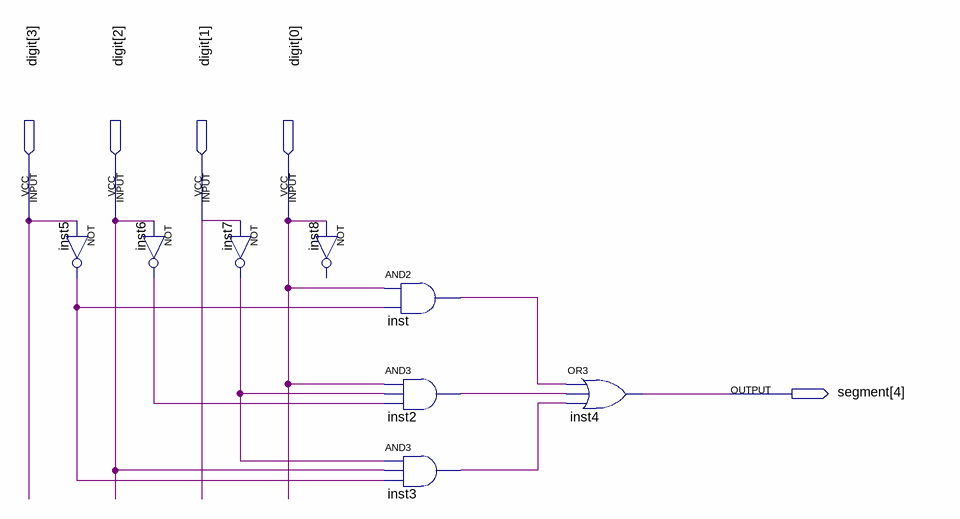
[diagram p0: schematic sheet]
// Quartus schematic segmentE.bdf as structural Verilog: 8 symbols, 5 pins
module segmentE (
  input  [3:0] digit,
  output [4:4] segment
);

  wire inst2_out, inst3_out, inst5_out, inst6_out, inst7_out, inst_out;

  not inst5 (inst5_out, digit[3]);
  not inst6 (inst6_out, digit[2]);
  not inst7 (inst7_out, digit[1]);
  // NOT inst8 has open pins: IN=digit[0], OUT=open
  and inst (inst_out, digit[0], inst5_out);
  and inst2 (inst2_out, digit[0], inst7_out, inst6_out);
  and inst3 (inst3_out, inst7_out, digit[2], inst5_out);
  or inst4 (segment[4], inst_out, inst2_out, inst3_out);
endmodule
